# EAGLE design sensornode cyclops (EAGLE 7.7.0)
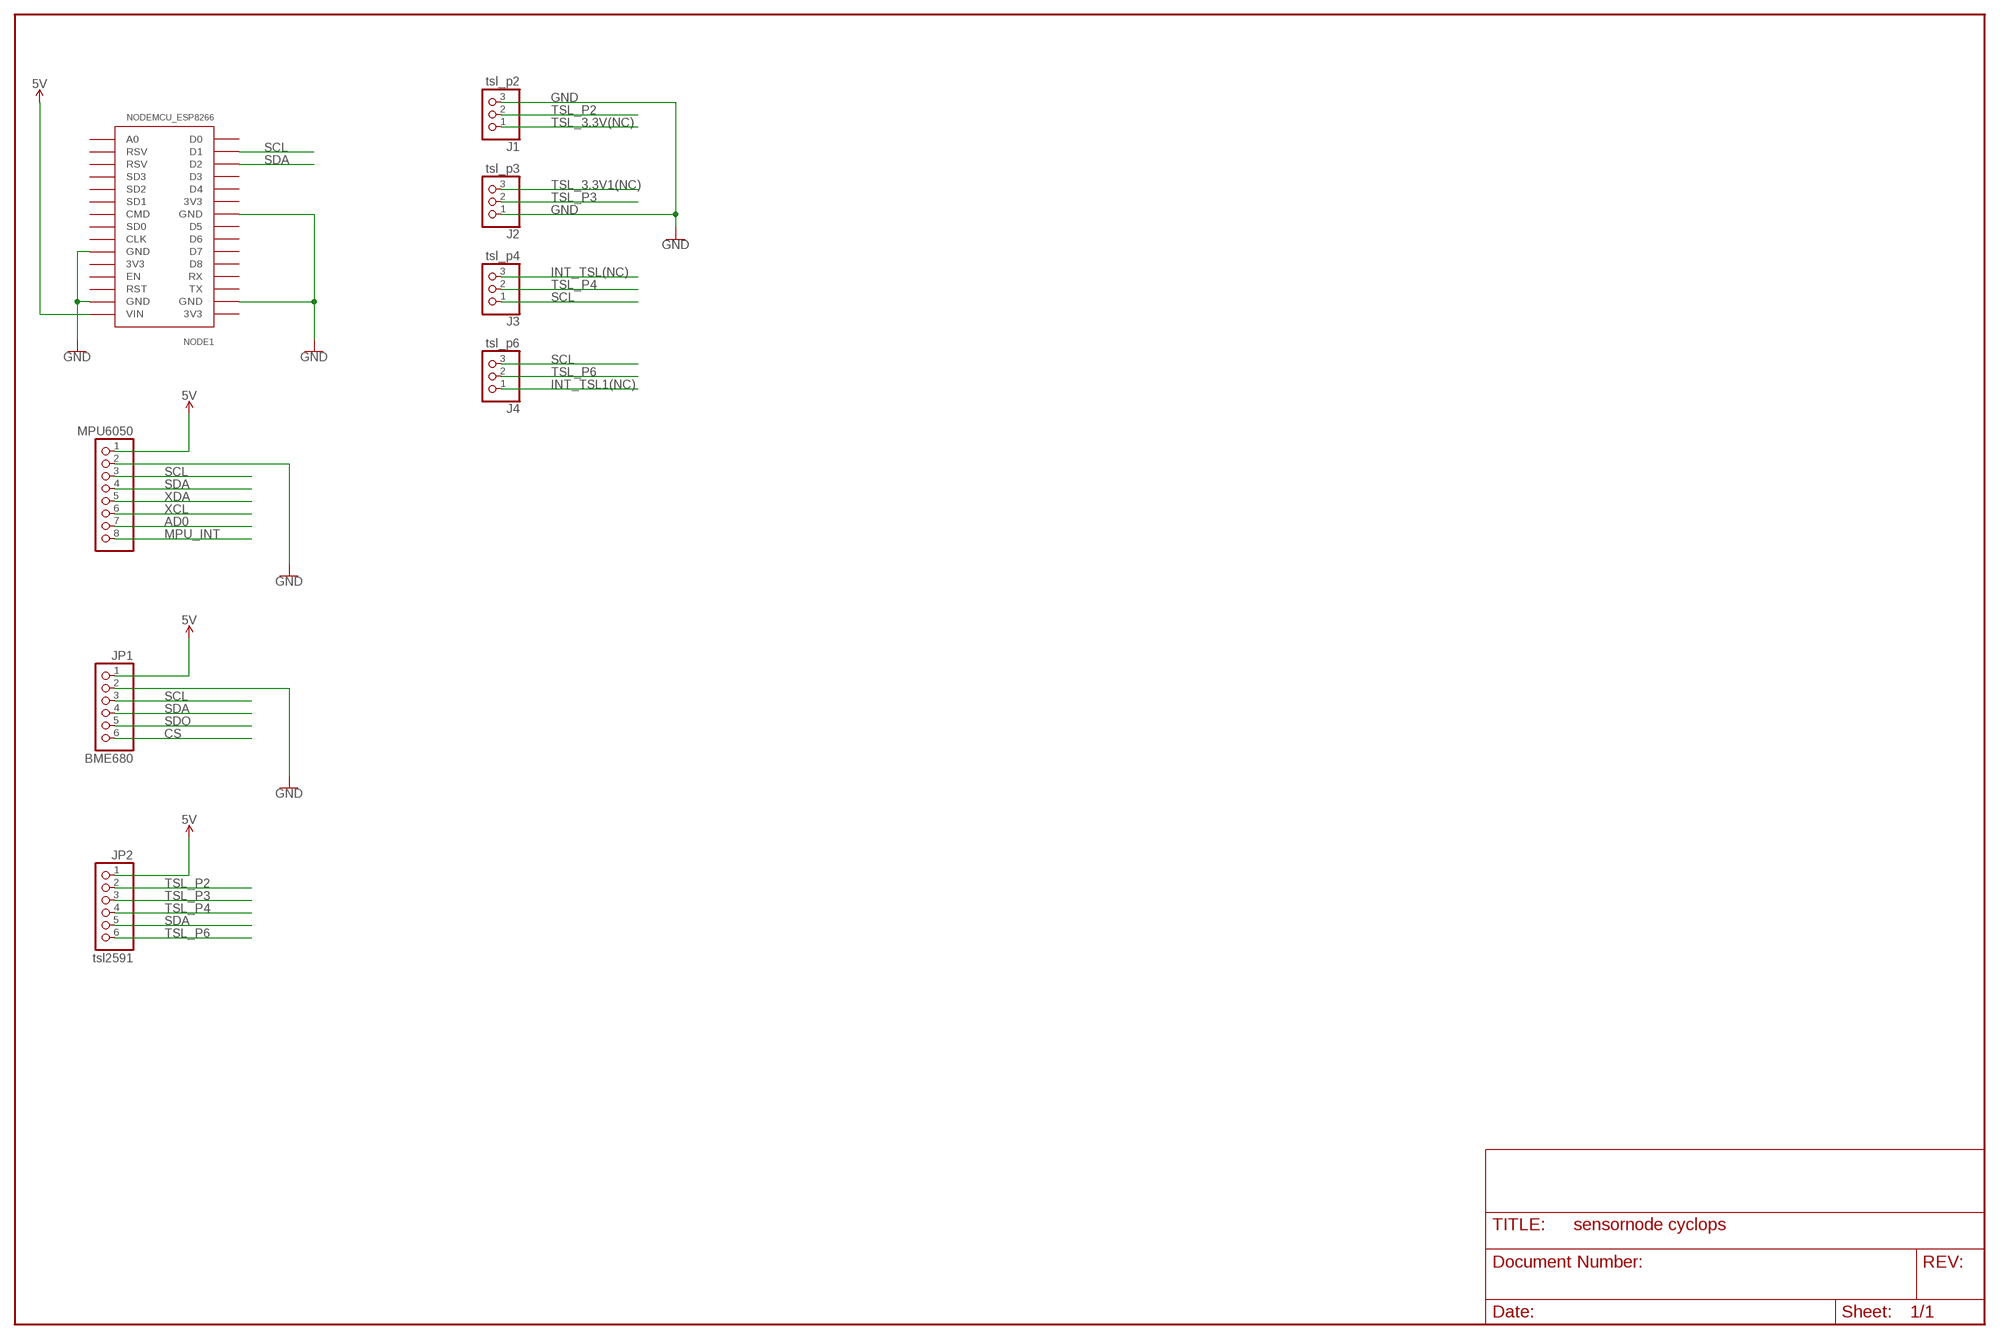
[diagram p0: schematic, sheet 1]

## Parts
J1  tsl_p2  PINHD-1X3  [1X03]
J2  tsl_p3  PINHD-1X3  [1X03]
J3  tsl_p4  PINHD-1X3  [1X03]
J4  tsl_p6  PINHD-1X3  [1X03]
JP1  BME680  PINHD-1X6  [1X06]
JP2  tsl2591  PINHD-1X6  [1X06]
MPU6050  PINHD-1X8  [1X08]
NODE1  NODEMCU_ESP8266  [NODEMCU_ESP8266]

## Nets
5V: JP1.1 JP2.1 MPU6050.1 NODE1.VIN
AD0: MPU6050.7
CS: JP1.6
GND: J1.3 J2.1 JP1.2 MPU6050.2 NODE1.GND@1(GND) NODE1.GND@2(GND) NODE1.GND@3(GND) NODE1.GND@4(GND)
INT_TSL1(NC): J4.1
INT_TSL(NC): J3.3
MPU_INT: MPU6050.8
SCL: J3.1 J4.3 JP1.3 MPU6050.3 NODE1.D1
SDA: JP1.4 JP2.5 MPU6050.4 NODE1.D2
SDO: JP1.5
TSL_3.3V1(NC): J2.3
TSL_3.3V(NC): J1.1
TSL_P2: J1.2 JP2.2
TSL_P3: J2.2 JP2.3
TSL_P4: J3.2 JP2.4
TSL_P6: J4.2 JP2.6
XCL: MPU6050.6
XDA: MPU6050.5
Unconnected: NODE1.A0 NODE1.CLK NODE1.CMD NODE1.D0 NODE1.D3 NODE1.D4 NODE1.D5 NODE1.D6 NODE1.D7 NODE1.D8 NODE1.EN NODE1.RST NODE1.RSV1(RSV) NODE1.RSV2(RSV) NODE1.RX NODE1.SD1 NODE1.SD2 NODE1.SD3 NODE1.SDO(SD0) NODE1.TX

## Power pins joined to a net without a drawn wire
3V3: NODE1.3V3@1(3V3) NODE1.3V3@2(3V3) NODE1.3V3@3(3V3)

## Library data of the parts
J1-J4 = adafruit:PINHD-1X3: PIN HEADER
JP1 JP2 = pinhead+:PINHD-1X6: PIN HEADER
MPU6050 = pinhead+:PINHD-1X8: PIN HEADER
NODE1 = nodemcu_esp8266:NODEMCU_ESP8266: Node MCU V2 (ESP8266) Created by Harish

## Board
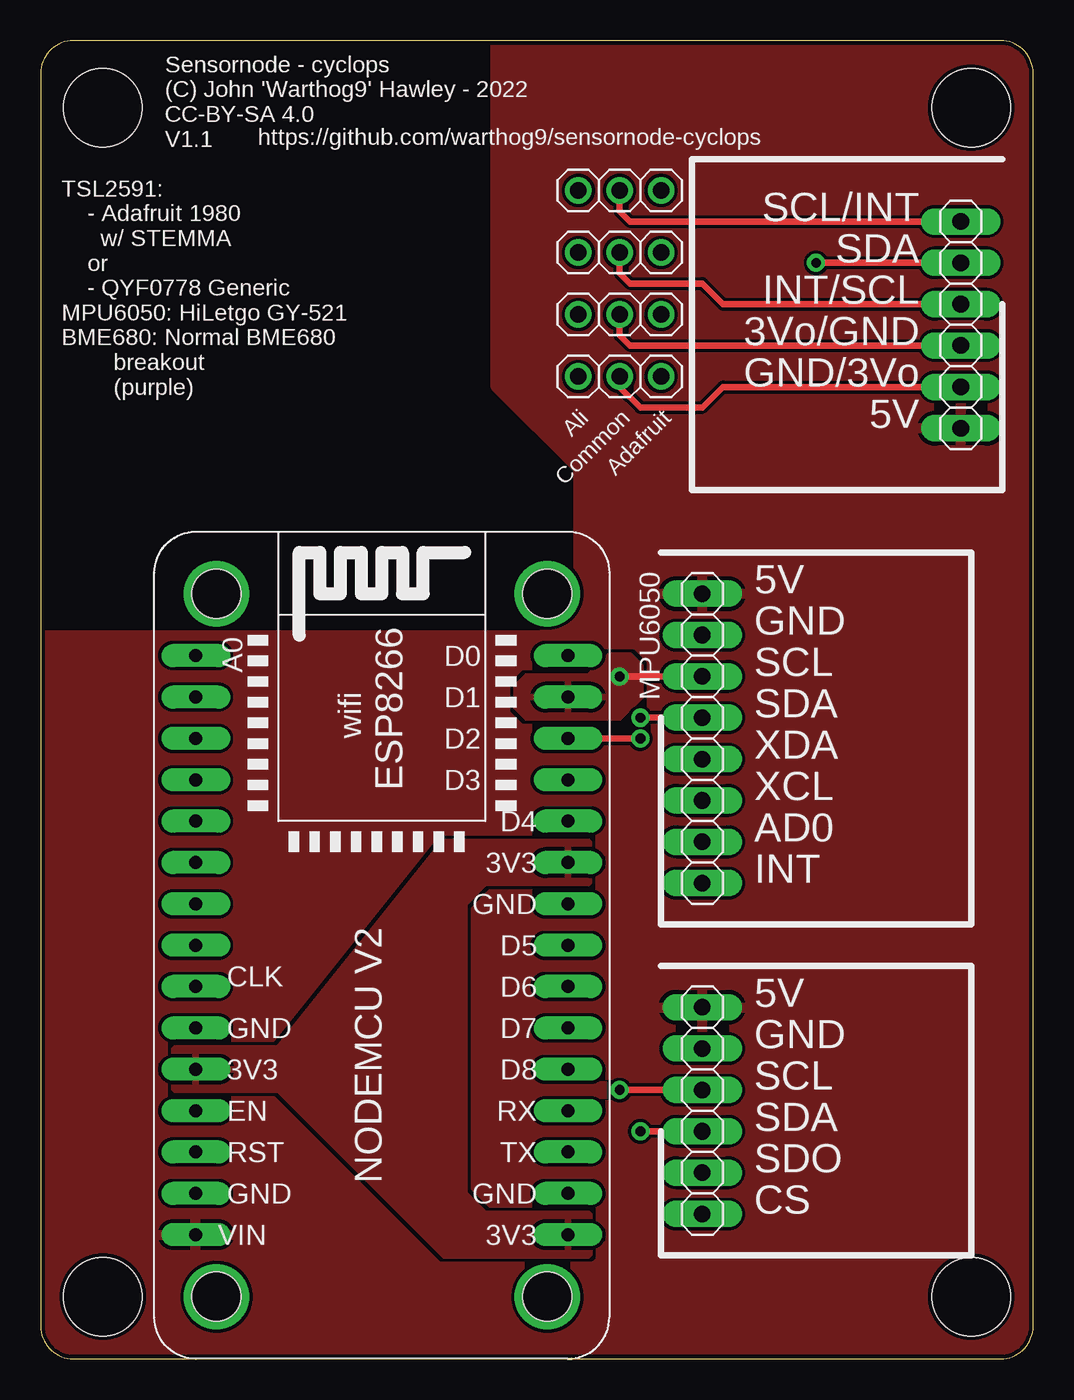
[diagram p1: board, top side]
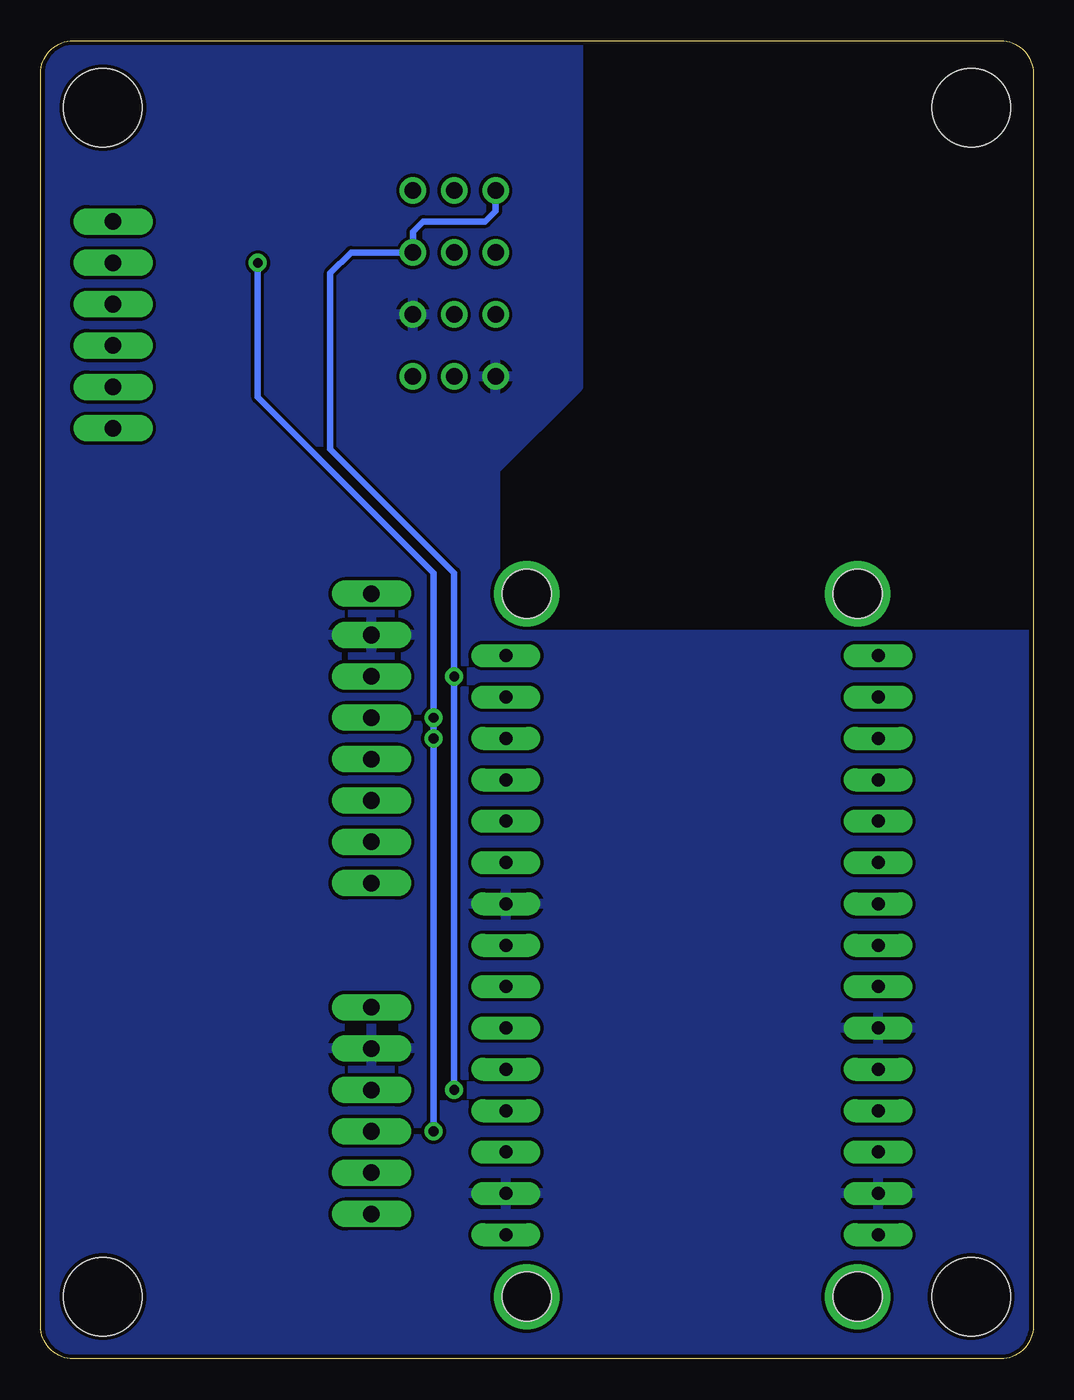
[diagram p2: board, bottom side, seen from below]

Size 60.96 x 80.95 mm. Coordinates in mm from the lower left corner, seen from the top.
Outline: 0,78.95 0,2 arc90 2,0 58.96,0 arc90 60.96,2 60.96,78.95 arc90 58.96,80.95 2,80.95 arc90 0,78.95
Copper layers (1*16): Top 0.035mm / dielectric 1.5mm / Bottom 0.035mm
Design rules "default *": minimum track width 8mil, minimum drill 20mil, track to track 8mil, track to pad 8mil, pad to pad 8mil, via to via 8mil, smd to smd 8mil, copper to edge 10mil, drill to drill 8mil, minimum pad ring 12mil, minimum via ring 10mil, stop-mask expansion 4mil, vias tented up to drill 25mil, thermal gap 10mil
Holes 4.8 mm at 3.81,76.83 57.15,76.83 57.15,3.81 3.81,3.81

### Footprints (pad centres in the part's own frame; a part is rotated, then mirrored left to right if it is on the bottom)
1X03 = drill 1.016: 1 -2.54,0; 2 0,0; 3 2.54,0
1X06 = drill 1.016 long: 1 -6.35,0; 2 -3.81,0; 3 -1.27,0; 4 1.27,0; 5 3.81,0; 6 6.35,0
1X08 = drill 1.016 long: 1 -8.89,0; 2 -6.35,0; 3 -3.81,0; 4 -1.27,0; 5 1.27,0; 6 3.81,0; 7 6.35,0; 8 8.89,0
NODEMCU_ESP8266 = drill 0.8 long: 3V3@1 -11.43,19.05; 3V3@2 -11.43,-3.81; 3V3@3 11.43,8.89; A0 11.43,-16.51; CLK 11.43,3.81; CMD 11.43,-1.27; D0 -11.43,-16.51; D1 -11.43,-13.97; D2 -11.43,-11.43; D3 -11.43,-8.89; D4 -11.43,-6.35; D5 -11.43,1.27; D6 -11.43,3.81; D7 -11.43,6.35; D8 -11.43,8.89; EN 11.43,11.43; GND@1 -11.43,16.51; GND@2 -11.43,-1.27; GND@3 11.43,6.35; GND@4 11.43,16.51; RST 11.43,13.97; RSV1 11.43,-11.43; RSV2 11.43,-13.97; RX -11.43,11.43; SD1 11.43,-3.81; SD2 11.43,-6.35; SD3 11.43,-8.89; SDO 11.43,1.27; TX -11.43,13.97; VIN 11.43,19.05 | drill 3: P$31 10.16,22.86; P$32 -10.16,22.86; P$33 -10.16,-20.32; P$34 10.16,-20.32 | hole 3: 10.16,22.86; 10.16,-20.32; -10.16,-20.32; -10.16,22.86

### Placement (x,y rotation side)
J1  35.56,60.33 180 top
J2  35.56,64.14 180 top
J3  35.56,67.94 180 top
J4  35.56,71.75 180 top
JP1  40.64,15.24 270 top
JP2  56.52,63.5 90 top
MPU6050  40.64,38.1 270 top
NODE1  20.95,26.67 180 top

### Tracks (layer width: path | path; a pad name or v marks a point on that pad's centre or on a via)
3V3
  pour Top: 8.26,19.05 14.61,19.05 24.77,31.75 33.66,31.75 34.29,31.11 34.29,29.84 33.66,29.21 27.3,29.21 26.04,27.94 26.04,10.16 27.3,8.89 33.66,8.89 34.29,8.26 34.29,6.99 33.66,6.35 24.77,6.35 14.61,16.51 8.26,16.51 7.62,17.14 7.62,18.41
5V
  pour Top (rank 6): -5.08,44.45 30.52,44.45 arc90 33.02,46.95 33.02,54.61 27.94,59.69 27.94,104.14 68.58,104.14 68.58,-5.08 -5.08,-5.08
GND
  pour Bottom (rank 6): -2.54,44.45 30.52,44.45 arc90 33.02,46.95 33.02,54.61 27.94,59.69 27.94,101.6 66.04,101.6 66.04,-2.54 -2.54,-2.54
SCL  (via drill 0.6)
  Top 0.406: JP1.3 v35.56,16.51 | v35.56,41.91 MPU6050.3
  Bottom 0.406: v35.56,16.51 v35.56,41.91 35.56,48.26 43.18,55.88 43.18,66.67 41.91,67.94 J3.1 38.1,69.22 37.47,69.85 33.66,69.85 33.02,70.48 J4.3
  pour Top: 29.21,41.27 29.84,41.91 33.66,41.91 34.92,43.18 36.2,43.18 36.83,42.55 36.83,40.64 35.56,39.37 29.84,39.37 29.21,40.01
SDA  (via drill 0.6)
  Top 0.406: v47.62,67.31 JP2.5 | MPU6050.4 v36.83,39.37 | JP1.4 v36.83,13.97 | NODE1.D2 v36.83,38.1
  Bottom 0.406: v36.83,13.97 v36.83,38.1 v36.83,39.37 36.83,48.26 47.62,59.05 v47.62,67.31
TSL_P2
  Top 0.406: J1.2 35.56,59.69 36.83,58.42 40.64,58.42 41.91,59.69 JP2.2
TSL_P3
  Top 0.406: J2.2 35.56,62.87 36.2,62.23 JP2.3
TSL_P4
  Top 0.406: J3.2 35.56,66.67 36.2,66.04 40.64,66.04 41.91,64.77 JP2.4
TSL_P6
  Top 0.406: J4.2 35.56,70.48 36.2,69.85 JP2.6

### Text on the board
tPlace: Sensornode - cyclops / (C) John 'Warthog9' Hawley - 2022 / CC-BY-SA 4.0 / V1.1 | https://github.com/warthog9/sensornode-cyclops | TSL2591: / - Adafruit 1980 / w/ STEMMA / or / - QYF0778 Generic / MPU6050: HiLetgo GY-521 / BME680: Normal BME680 / breakout / (purple) | SCL/INT | SDA | INT/SCL | 3Vo/GND | GND/3Vo | Ali | Common | Adafruit | 5V | 5V | GND | SCL | SDA | XDA | XCL | AD0 | INT | 5V | GND | SCL | SDA | SDO | CS